# Altium project BluetoothAdapter1.0.PrjPcb
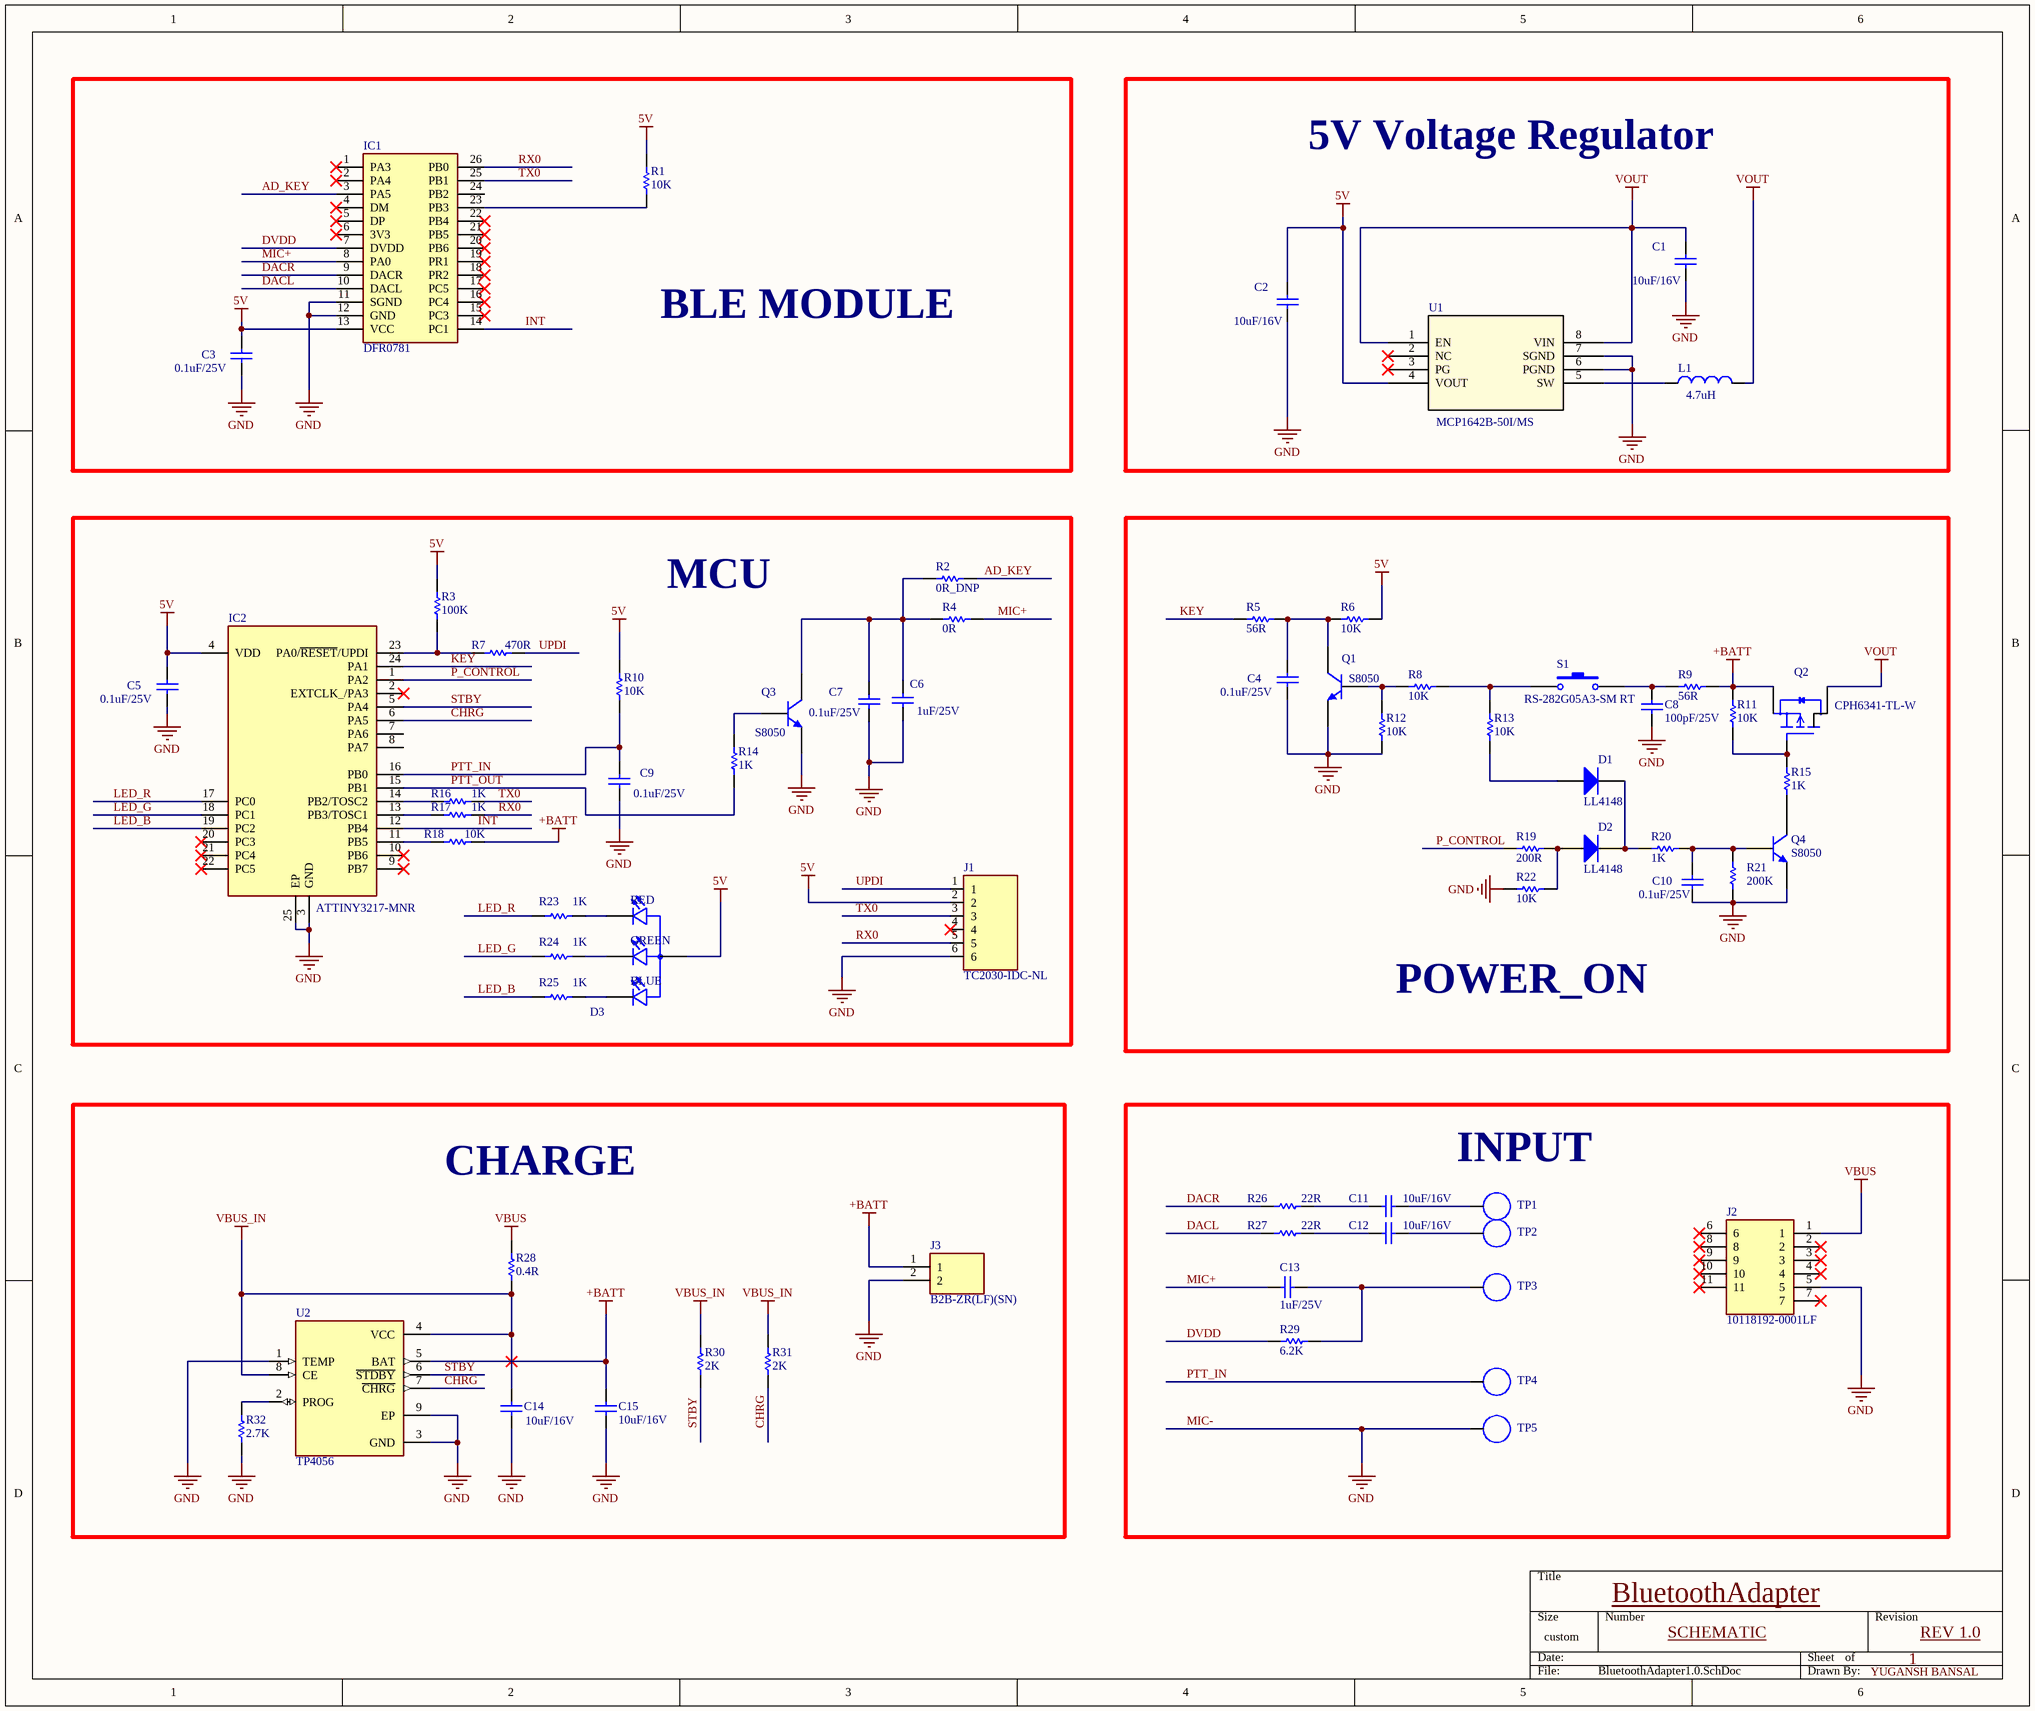
[diagram p0: BluetoothAdapter1.0.SchDoc]
1 sheet, 68 parts. Net scope: global (net labels, ports and power ports of the same name join across sheets).
Board file: BluetoothAdapter1.0.PcbDoc

## Sheet BluetoothAdapter1.0.SchDoc
size 381 x 320 mm

### Parts
C1  value 10uF/16V  [C0603S]  (hidden comment: CAP CER 10UF 16V X5R 0603)
C2  value 10uF/16V  [C0603S]  (hidden comment: CAP CER 10UF 16V X5R 0603)
C3  value 0.1uF/25V  [C0603S]  (hidden comment: CAP CER 0.1UF 25V X7R 0603)
C4  value 0.1uF/25V  [C0603S]  (hidden comment: CAP CER 0.1UF 25V X7R 0603)
C5  value 0.1uF/25V  [C0603S]  (hidden comment: CAP CER 0.1UF 25V X7R 0603)
C6  value 1uF/25V  [C0603S]  (hidden comment: CAP CER 1UF 25V X7R 0603)
C7  value 0.1uF/25V  [C0603S]  (hidden comment: CAP CER 0.1UF 25V X7R 0603)
C8  value 100pF/25V  [C0603S]  (hidden comment: CAP CER 100PF 25V X7R 0603)
C9  value 0.1uF/25V  [C0603S]  (hidden comment: CAP CER 0.1UF 25V X7R 0603)
C10  value 0.1uF/25V  [C0603S]  (hidden comment: CAP CER 0.1UF 25V X7R 0603)
C11  value 10uF/16V  [C0603S]  (hidden comment: CAP CER 10UF 16V X5R 0603)
C12  value 10uF/16V  [C0603S]  (hidden comment: CAP CER 10UF 16V X5R 0603)
C13  value 1uF/25V  [C0603S]  (hidden comment: CAP CER 1UF 25V X7R 0603)
C14  value 10uF/16V  [C0603S]  (hidden comment: CAP CER 10UF 16V X5R 0603)
C15  value 10uF/16V  [C0603S]  (hidden comment: CAP CER 10UF 16V X5R 0603)
D1  value LL4148  [DIO_LL4148]  (hidden comment: DIODE GEN PURP 100V 200MA SOD80)
D2  value LL4148  [DIO_LL4148]  (hidden comment: DIODE GEN PURP 100V 200MA SOD80)
D3  LED RGB MIXED WHITE ( 1.6(L)X1.6  [LED_B38G3RGB-10D0003H2U1930]  (value not drawn)
IC1  value DFR0781  [DFR0781]  (hidden comment: AUDIO BLE/SPP PASS-THROUGH MODU)
IC2  value ATTINY3217-MNR  [QFN50P400X400X90-25N-D]  (hidden comment: IC MCU 8BIT 32KB FLASH 24VQFN)
J1  TC2030-IDC-NL  [TAG_TC2030-IDC-NL]
J2  value 10118192-0001LF  [101181920001LF]  (hidden comment: CONN RCPT USB2.0 MICRO B SMD R/A)
J3  value B2B-ZR(LF)(SN)  [SHDR2W50P0X150_1X2_450X350X450P]  (hidden comment: CONN HEADER VERT 2POS 1.5MM)
L1  value 4.7uH  [INDC2520X100N]  (hidden comment: FIXED IND 4.7UH 1.3A 120MOHM SMD)
Q1  value S8050  [SOT23-3D]  (hidden comment: TRANS NPN 25V 0.5A SOT23)
Q2  value CPH6341-TL-W  [SOT95P285X140-6N]  (hidden comment: MOSFET P-CH 30V 5A 6CPH)
Q3  value S8050  [SOT23-3D]  (hidden comment: TRANS NPN 25V 0.5A SOT23)
Q4  value S8050  [SOT23-3D]  (hidden comment: TRANS NPN 25V 0.5A SOT23)
R1  value 10K  [R0603S]  (hidden comment: RES 10K OHM 1% 1/10W 0603)
R2  value 0R_DNP  [R0603S]  (hidden comment: RES 0OHM 1% 1/10W 0603)
R3  value 100K  [R0603S]  (hidden comment: RES 100K OHM 1% 1/10W 0603)
R4  value 0R  [R0603S]  (hidden comment: RES 0OHM 1% 1/10W 0603)
R5  value 56R  [R0603S]  (hidden comment: RES 56 OHM 1% 1/10W 0603)
R6  value 10K  [R0603S]  (hidden comment: RES 10K OHM 1% 1/10W 0603)
R7  value 470R  [R0603S]  (hidden comment: RES 470 OHM 1% 1/10W 0603)
R8  value 10K  [R0603S]  (hidden comment: RES 10K OHM 1% 1/10W 0603)
R9  value 56R  [R0603S]  (hidden comment: RES 56 OHM 1% 1/10W 0603)
R10  value 10K  [R0603S]  (hidden comment: RES 10K OHM 1% 1/10W 0603)
R11  value 10K  [R0603S]  (hidden comment: RES 10K OHM 1% 1/10W 0603)
R12  value 10K  [R0603S]  (hidden comment: RES 10K OHM 1% 1/10W 0603)
R13  value 10K  [R0603S]  (hidden comment: RES 10K OHM 1% 1/10W 0603)
R14  value 1K  [R0603S]  (hidden comment: RES 1K OHM 1% 1/10W 0603)
R15  value 1K  [R0603S]  (hidden comment: RES 1K OHM 1% 1/10W 0603)
R16  value 1K  [R0603S]  (hidden comment: RES 1K OHM 1% 1/10W 0603)
R17  value 1K  [R0603S]  (hidden comment: RES 1K OHM 1% 1/10W 0603)
R18  value 10K  [R0603S]  (hidden comment: RES 10K OHM 1% 1/10W 0603)
R19  value 200R  [R0603S]  (hidden comment: RES 200 OHM 1% 1/10W 0603)
R20  value 1K  [R0603S]  (hidden comment: RES 1K OHM 1% 1/10W 0603)
R21  value 200K  [R0603S]  (hidden comment: RES 200K OHM 1% 1/10W 0603)
R22  value 10K  [R0603S]  (hidden comment: RES 10K OHM 1% 1/10W 0603)
R23  value 1K  [R0603S]  (hidden comment: RES 1K OHM 1% 1/10W 0603)
R24  value 1K  [R0603S]  (hidden comment: RES 1K OHM 1% 1/10W 0603)
R25  value 1K  [R0603S]  (hidden comment: RES 1K OHM 1% 1/10W 0603)
R26  value 22R  [R0603S]  (hidden comment: RES 22 OHM 5% 1/10W 0603)
R27  value 22R  [R0603S]  (hidden comment: RES 22 OHM 5% 1/10W 0603)
R28  value 0.4R  [R1206S]  (hidden comment: RES 0.4 OHM 1% 1/4W 1206)
R29  value 6.2K  [R0603S]  (hidden comment: RES 6.2K OHM 1% 1/10W 0603)
R30  value 2K  [R0603S]  (hidden comment: RES 2K OHM 1% 1/10W 0603)
R31  value 2K  [R0603S]  (hidden comment: RES 2K OHM 1% 1/10W 0603)
R32  value 2.7K  [R0603S]  (hidden comment: RES 2.7K OHM 1% 1/10W 0603)
S1  value RS-282G05A3-SM RT  [RS282G05A3SMRT]  (hidden comment: SWITCH TACTILE SPST-NO 0.05A 12V)
TP1  TP  [TP]  (value not drawn)
TP2  TP  [TP]  (value not drawn)
TP3  TP  [TP]  (value not drawn)
TP4  TP  [TP]  (value not drawn)
TP5  TP  [TP]  (value not drawn)
U1  value MCP1642B-50I/MS  [MCP1642B-50I/MS]  (hidden comment: IC REG BOOST 5V 800MA 8MSOP)
U2  value TP4056  [SOP127P600X175-9N]  (hidden comment: ESOP-8 Battery Management ICs)

### Blocks framed on the sheet
BLE MODULE: C3 IC1 R1
5V Voltage Regulator: C1 C2 L1 U1
MCU: C5-C7 C9 D3 IC2 J1 Q3 R2-R4 R7 R10 R14 R16-R18 R23-R25
POWER_ON: C4 C8 C10 D1 D2 Q1 Q2 Q4 R5 R6 R8 R9 R11-R13 R15 R19-R22 S1
CHARGE: C14 C15 J3 R28 R30-R32 U2
INPUT: C11-C13 J2 R26 R27 R29 TP1-TP5

### Nets
5V: C2.2 C3.1 C5.1 D3.3(A) IC1.13(VCC) IC2.4(VDD) J1.2 R1.2 R3.1 R6.1 R10.1 U1.4(VOUT)
+BATT: C15.2 J3.1 Q2.4(S) R9.2 R11.1 R18.2 U2.5(BAT)
MIC-: C1.1 C2.1 C3.2 C4.2 C5.2 C6.2 C7.2 C8.1 C9.2 C10.2 C14.1 C15.1 IC1.11(SGND) IC1.12(GND) IC2.3(GND) IC2.25(EP) J1.6 J2.5 J3.2 Q1.3(E) Q3.3(E) Q4.3(E) R12.2 R21.1 R22.1 R32.2 TP5.1 U1.6(PGND) U1.7(SGND) U2.1(TEMP) U2.3(GND) U2.9(EP)  [also labelled GND]
VBUS: J2.1 R28.1
VBUS_IN: C14.2 R28.2 R30.1 R31.1 U2.4(VCC) U2.8(CE)
VOUT: C1.2 L1.2 Q2.6(D@4) U1.1(EN) U1.8(VIN)
AD_KEY: IC1.3(PA5) R2.1
CHRG: IC2.6(PA5) R31.2 U2.7(~{CHRG})
DACL: IC1.10(DACL) R27.1
DACR: IC1.9(DACR) R26.1
DVDD: IC1.7(DVDD) R29.1
INT: IC1.14(PC1) IC2.12(PB4)
KEY: IC2.24(PA1) R5.1
LED_B: IC2.19(PC2) R25.1
LED_G: IC2.18(PC1) R24.1
LED_R: IC2.17(PC0) R23.1
MIC+: C13.1 IC1.8(PA0) R4.2
P_CONTROL: IC2.1(PA2) R19.1
PTT_IN: C9.1 IC2.16(PB0) R10.2 TP4.1
PTT_OUT: IC2.15(PB1) R14.1
RX0: IC1.26(PB0) J1.5 R17.2
STBY: IC2.5(PA4) R30.2 U2.6(~{STDBY})
TX0: IC1.25(PB1) J1.3 R16.2
UPDI: J1.1 R7.1
NetC4_1: C4.1 Q1.2(C) R5.2 R6.2
NetC6_1: C6.1 C7.1 Q3.2(C) R2.2 R4.1
NetC8_2: C8.2 R9.1 S1.2
NetC10_1: C10.1 Q4.1(B) R20.1 R21.2
NetC11_1: C11.1 TP1.1
NetC11_2: C11.2 R26.2
NetC12_1: C12.1 TP2.1
NetC12_2: C12.2 R27.2
NetC13_2: C13.2 R29.2 TP3.1
NetD1_1: D1.1(A) R13.2
NetD1_2: D1.2(K) D2.2(K) R20.2
NetD2_1: D2.1(A) R19.2 R22.2
NetD3_1: D3.1(G_C) R24.2
NetD3_2: D3.2(B_C) R25.2
NetD3_4: D3.4(R_C) R23.2
NetIC1_23: IC1.23(PB3) R1.1
NetIC2_11: IC2.11(PB5) R18.1
NetIC2_13: IC2.13(PB3/TOSC1) R17.1
NetIC2_14: IC2.14(PB2/TOSC2) R16.1
NetIC2_23: IC2.23(PA0/~{RESET}/UPDI) R3.2 R7.2
NetL1_1: L1.1 U1.5(SW)
NetQ1_1: Q1.1(B) R8.2 R12.1
NetQ2_3: Q2.3(G) R11.2 R15.1
NetQ3_1: Q3.1(B) R14.2
NetQ4_2: Q4.2(C) R15.2
NetR8_1: R8.1 R13.1 S1.1
NetR32_1: R32.1 U2.2(PROG)

Not connected (* = marked no-connect by the designer): IC1 1(PA3)* 2(PA4)* 4(DM)* 5(DP)* 6(3V3)* 15(PC3)* 16(PC4)* 17(PC5)* 18(PR2)* 19(PR1)* 20(PB6)* 21(PB5)* 22(PB4)* 24(PB2); IC2 2(EXTCLK_/PA3)* 7(PA6) 8(PA7) 9(PB7)* 10(PB6)* 20(PC3)* 21(PC4)* 22(PC5)*; J1 4*; J2 2* 3* 4* 6* 7* 8* 9* 10* 11*; Q2 1(D@1) 2(D@2) 5(D@3); U1 2(NC)* 3(PG)*

### Notes on the sheet
- BluetoothAdapter
- SCHEMATIC
- 1
- YUGANSH BANSAL
- REV 1.0
- (in symbol B38G3RGB-10D0003H2U1930) RED; GREEN; BLUE

### Library data of the parts
C1 C2 C11 C12 C14 C15 = Cap: 10 µF ±20% 16V Ceramic Capacitor X5R 0603 (1608 Metric); Manufacturer: Murata Electronics; Manufacturer Product Number: GRM188R61C106MAALD; TemperatureCoefficient: X5R; Digi-Key Part Number: 490-10729-6-ND; Digi-Key PurchaseURL: https://www.digikey.com/en/products/detail/murata-electronics/GRM188R61C106MAALD/4905340
C3-C5 C7 C9 C10 = Cap: 0.1 µF ±10% 25V Ceramic Capacitor X7R 0603 (1608 Metric); Manufacturer: KEMET; Manufacturer Product Number: C0603C104K3RAC7867; TemperatureCoefficient: X7R; Digi-Key Part Number: 399-C0603C104K3RAC7867TR-ND; Digi-Key PurchaseURL: https://www.digikey.com/en/products/detail/kemet/C0603C104K3RAC7867/416044
C6 C13 = Cap: 1 µF ±10% 25V Ceramic Capacitor X7R 0603 (1608 Metric); Manufacturer: KEMET; Manufacturer Product Number: C0603C105K3RAC7867; TemperatureCoefficient: X7R; Digi-Key Part Number: 399-C0603C105K3RAC7867DKR-ND; Digi-Key PurchaseURL: https://www.digikey.com/en/products/detail/kemet/C0603C105K3RAC7867/3317582?s=N4IgTCBcDaIMIAYBsCDMcCMCCsBpVASgIJwDsAHEqSALoC%2BQA
C8 = Cap: 0.1 µF ±10% 25V Ceramic Capacitor X7R 0603 (1608 Metric); Manufacturer: KEMET; Manufacturer Product Number: C0603C101K3RACAUTO; TemperatureCoefficient: X7R; Digi-Key Part Number: 399-C0603C101K3RACAUTODKR-ND; Digi-Key PurchaseURL: https://www.digikey.com/en/products/detail/kemet/C0603C101K3RACAUTO/10642423
D1 D2 = Diode: Diode Standard 100 V 200mA Surface Mount SOD-80; Manufacturer: onsemi; TemperatureCoefficient: -55°C ~ 175°C; Manufacturer Product Number: LL4148; Digi-Key Part Number: LL4148FSCT-ND; Digi-Key PurchaseURL: https://www.digikey.com/en/products/detail/onsemi/LL4148/1923046; LCSC Part Number: C9808; LCSC Purchase URL: https://www.lcsc.com/product-detail/Switching-Diode_ST-Semtech-LL4148_C9808.html
D3 = B38G3RGB-10D0003H2U1930: Red, Green, Blue (RGB) LED Indication - Discrete 2V Red, 3V Green, 3V Blue 0606 (1616 Metric); Manufacturer: Harvatek Corporation; Manufacturer Product Number: B38G3RGB-10D0003H2U1930; Digi-Key Part Number: 3147-B38G3RGB-10D0003H2U1930DKR-ND; Digi-Key PurchaseURL: https://www.digikey.com/en/products/detail/harvatek-corporation/B38G3RGB-10D0003H2U1930/13588733?s=N4IgTCBcDaIEIGYAcBxBAlFcC0BGADACL4kIASYAqrgJwL4gC6AvkA; Value: B38G3RGB-10D0003H2U1930
IC1 = DFR0781: Bluetooth Bluetooth v5.0 Transceiver Module Antenna Not Included Surface Mount; Manufacturer: DFRobot; Manufacturer Product Number: DFR0781; Digi-Key Part Number: 1738-DFR0781-ND; Digi-Key PurchaseURL: https://www.digikey.com/en/products/detail/dfrobot/DFR0781/13688344?s=N4IgTCBcDaICYDMBOAGA7ADgIwgLoF8g
IC2 = ATTINY3217-MNR: AVR tinyAVR™ 1, Functional Safety (FuSa) Microcontroller IC 8-Bit 20MHz 32KB (32K x 8) FLASH 24-VQFN (4x4); Manufacturer: Microchip; Manufacturer Product Number: ATTINY3217-MNR; Digi-Key Part Number: ATTINY3217-MNRDKR-ND; Digi-Key PurchaseURL: https://www.digikey.com/en/products/detail/microchip-technology/ATTINY3217-MNR/9477738?s=N4IgTCBcDaIIIBUEEkByBNAzGAjAdgFoBZVAJRAF0BfIA
J1 = TC2030-IDC-NL: 6-PIN PLUG-OF-NAILS CABLE 6; MF: Tag-Connect; Package: Package Analog Devices; Availability: Unavailable; Value: *; MP: TC2030-IDC-NL; SnapEDA_Link: https://www.snapeda.com/parts/TC2030-IDC-NL/Tag-Connect/view-part/2783029/?ref=snap; Price: None
J2 = 10118192-0001LF: USB - micro B USB 2.0 Receptacle Connector 5 Position Surface Mount, Right Angle; Manufacturer: Amphenol; Manufacturer Product Number: 10118192-0001LF; Digi-Key Part Number: 609-4613-6-ND; Digi-Key PurchaseURL: https://www.digikey.com/en/products/detail/amphenol-cs-fci/10118192-0001LF/2785387?s=N4IgTCBcDaIIwAY5wBxwJxgLQN3AMgGIgC6AvkA
J3 = B2B-ZR(LF)(SN): Connector Header Through Hole 2 position 0.059" (1.50mm); Manufacturer: JST (JAPAN SOLDERLESS TERMINALS); Manufacturer Product Number: B2B-ZR(LF)(SN); Digi-Key Part Number: 455-1657-ND; Digi-Key PurchaseURL: https://www.digikey.com/en/products/detail/jst-sales-america-inc/B2B-ZR-LF-SN/926564
L1 = AIML-1008HC-4R7M-T: 4.7 µH Shielded Multilayer Inductor 1.3 A 120mOhm 1008 (2520 Metric); Manufacturer: Abracon LLC; Manufacturer Product Number: AIML-1008HC-4R7M-T; Digi-Key Part Number: 535-12797-6-ND; Digi-Key PurchaseURL: https://www.digikey.com/en/products/detail/abracon-llc/AIML-1008HC-4R7M-T/5043494?s=N4IgTCBcDaIIIEkCyAZAtARgAxYBwAkBhNAFgCUB2JNAFRAF0BfIA
Q1 Q3 Q4 = S8050: Bipolar (BJT) Transistor NPN 25 V 500 mA 150MHz 300 mW Surface Mount SOT-23; Manufacturer: MDD; Manufacturer Product Number: S8050; Digi-Key Part Number: 3372-S8050TR-ND; Digi-Key PurchaseURL: https://www.digikey.com/en/products/detail/nextgen-components/S8050/16602420
Q2 = CPH6341-TL-W: P-Channel 30 V 5A (Ta) 1.6W (Ta) Surface Mount 6-CPH; Manufacturer: onsemi; Manufacturer Product Number: CPH6341-TL-W; Digi-Key Part Number: CPH6341-TL-WOSDKR-ND; Digi-Key PurchaseURL: https://www.digikey.com/en/products/detail/onsemi/CPH6341-TL-W/4847611
R1 R6 R8 R10-R13 R18 R22 = R0603: 10 kOhms ±1% 0.1W, 1/10W Chip Resistor 0603 (1608 Metric) Moisture Resistant Thick Film; Manufacturer: YAGEO; Manufacturer Product Number: RC0603FR-0710KL; Digi-Key Part Number: 311-10.0KHRCT-ND; Digi-Key PurchaseURL: https://www.digikey.com/en/products/detail/yageo/RC0603FR-0710KL/726880
R2 R4 = R0603: 0Ohms ±1% 0.1W, 1/10W Chip Resistor 0603 (1608 Metric) Moisture Resistant Thick Film; Manufacturer: YAGEO; Manufacturer Product Number: RC0603JR-070RL; Digi-Key Part Number: 311-0.0GRDKR-ND; Digi-Key PurchaseURL: https://www.digikey.com/en/products/detail/yageo/RC0603JR-070RL/726675
R3 = R0603: 100 kOhms ±1% 0.1W, 1/10W Chip Resistor 0603 (1608 Metric) Moisture Resistant Thick Film; Manufacturer: YAGEO; Manufacturer Product Number: RC0603FR-07100KL; Digi-Key Part Number: 311-100KHRDKR-ND; Digi-Key PurchaseURL: https://www.digikey.com/en/products/detail/yageo/RC0603FR-07100KL/726889?s=N4IgTCBcDaIEoGEAMA2JBmAYnAtEg7AIxJIDSAMiALoC%2BQA
R5 R9 = R0603: 1 kOhms ±1% 0.1W, 1/10W Chip Resistor 0603 (1608 Metric) Moisture Resistant Thick Film; Manufacturer: YAGEO; Manufacturer Product Number: RC0603FR-0756RL; Digi-Key Part Number: 311-56.0HRDKR-ND; Digi-Key PurchaseURL: https://www.digikey.com/en/products/detail/yageo/RC0603FR-0756RL/727301
R7 = R0603: 470 Ohms ±1% 0.1W, 1/10W Chip Resistor 0603 (1608 Metric) Moisture Resistant Thick Film; Manufacturer: YAGEO; Manufacturer Product Number: RC0603FR-07470RL; Digi-Key Part Number: 311-470HRDKR-ND; Digi-Key PurchaseURL: https://www.digikey.com/en/products/detail/yageo/RC0603FR-07470RL/727256
R14-R17 R20 R23-R25 = R0603: 1 kOhms ±1% 0.1W, 1/10W Chip Resistor 0603 (1608 Metric) Moisture Resistant Thick Film; Manufacturer: YAGEO; Manufacturer Product Number: RC0603FR-071KL; Digi-Key Part Number: 311-1.00KHRTR-ND; Digi-Key PurchaseURL: https://www.digikey.com/en/products/detail/yageo/RC0603FR-071KL/726843
R19 = R0603: 10 kOhms ±1% 0.1W, 1/10W Chip Resistor 0603 (1608 Metric) Moisture Resistant Thick Film; Manufacturer: YAGEO; Manufacturer Product Number: RC0603FR-07200RL; Digi-Key Part Number: 311-200HRDKR-ND; Digi-Key PurchaseURL: https://www.digikey.com/en/products/detail/yageo/RC0603FR-07200RL/727043
R21 = R0603: 100 kOhms ±1% 0.1W, 1/10W Chip Resistor 0603 (1608 Metric) Moisture Resistant Thick Film; Manufacturer: YAGEO; Manufacturer Product Number: RC0603FR-10200KL; Digi-Key Part Number: 13-RC0603FR-10200KLDKR-ND; Digi-Key PurchaseURL: https://www.digikey.com/en/products/detail/yageo/RC0603FR-10200KL/14008344
R26 R27 = R0603: 22 Ohms ±5% 0.1W, 1/10W Chip Resistor 0603 (1608 Metric) Moisture Resistant Thick Film; Manufacturer: YAGEO; Manufacturer Product Number: RC0603JR-0722RL; Digi-Key Part Number: 311-22GRDKR-ND; Digi-Key PurchaseURL: https://www.digikey.com/en/products/detail/yageo/RC0603JR-0722RL/726743?s=N4IgTCBcDaIEoGEAMA2JBmAUnAtEg7GGHADIgC6AvkA
R28 = R0603: 400 mOhms ±1% 0.25W, 1/4W Chip Resistor 1206 (3216 Metric) Automotive AEC-Q200, Current Sense, Moisture Resistant Thick Film; Manufacturer: YAGEO; Manufacturer Product Number: RL1206FR-070R4L; Digi-Key Part Number: 311-.4LWDKR-ND; Digi-Key PurchaseURL: https://www.digikey.com/en/products/detail/yageo/RL1206FR-070R4L/3886028
R29 = R0603: 6.2 kOhms ±1% 0.1W, 1/10W Chip Resistor 0603 (1608 Metric) Moisture Resistant Thick Film; Manufacturer: YAGEO; Manufacturer Product Number: RC0603FR-076K2L; Digi-Key Part Number: 311-6.20KHRDKR-ND; Digi-Key PurchaseURL: https://www.digikey.com/en/products/detail/yageo/RC0603FR-076K2L/727319?s=N4IgTCBcDaIEoGEAMA2JBmAYnAtEg7CgNJgAyIAugL5A
R30 R31 = R0603: 2 kOhms ±1% 0.1W, 1/10W Chip Resistor 0603 (1608 Metric) Moisture Resistant Thick Film; Manufacturer: YAGEO; Manufacturer Product Number: RC0603FR-072KL; Digi-Key Part Number: 311-2.00KHRDKR-ND; Digi-Key PurchaseURL: https://www.digikey.com/en/products/detail/yageo/RC0603FR-072KL/727009
R32 = R0603: 2.7 kOhms ±1% 0.1W, 1/10W Chip Resistor 0603 (1608 Metric) Moisture Resistant Thick Film; Manufacturer: YAGEO; Manufacturer Product Number: RC0603FR-072K7L; Digi-Key Part Number: 311-2.70KHRDKR-ND; Digi-Key PurchaseURL: https://www.digikey.com/en/products/detail/yageo/RC0603FR-072K7L/727032
S1 = RS282G05A3SMRT: Tactile Switch SPST-NO Top Actuated Surface Mount; Manufacturer: C & K COMPONENTS; Manufacturer Product Number: RS-282G05A3-SM RT; Digi-Key Part Number: CKN10384DKR-ND; Digi-Key PurchaseURL: https://www.digikey.com/en/products/detail/c-k/RS-282G05A3-SM-RT/2747190
U1 = MCP1642B-50I/MS: Boost Switching Regulator IC Positive Fixed 5V 1 Output 800mA 8-TSSOP, 8-MSOP (0.118", 3.00mm Width); Manufacturer: Microchip Technology; Manufacturer Product Number: MCP1642B-50I/MS; Digi-Key Part Number: MCP1642B-50I/MS-ND; Digi-Key PurchaseURL: https://www.digikey.com/en/products/detail/microchip-technology/MCP1642B-50I-MS/5137716?s=N4IgTCBcDaILIGEAKBGAbAFjAIQLQFYAGASQHo4BlEAXQF8g
U2 = TP4056: Complete single cell Li-Ion battery with a constant current / constant voltage linear charger; Manufacturer: TPOWER semiconductor Co.,LTD.; Manufacturer Product Number: TP4056; Digi-Key Part Number: C382139; Digi-Key Purchase URL: https://www.lcsc.com/product-detail/Battery-Management-ICs_TPOWER-TP4056_C382139.html